# Altium schematic sheet BI5.SchDoc
size 420 x 297 mm; DocumentNumber: 10; SheetNumber: 10; SheetTotal: 13; DecimalNumber: СНАБ.468222.001 ЭЗ
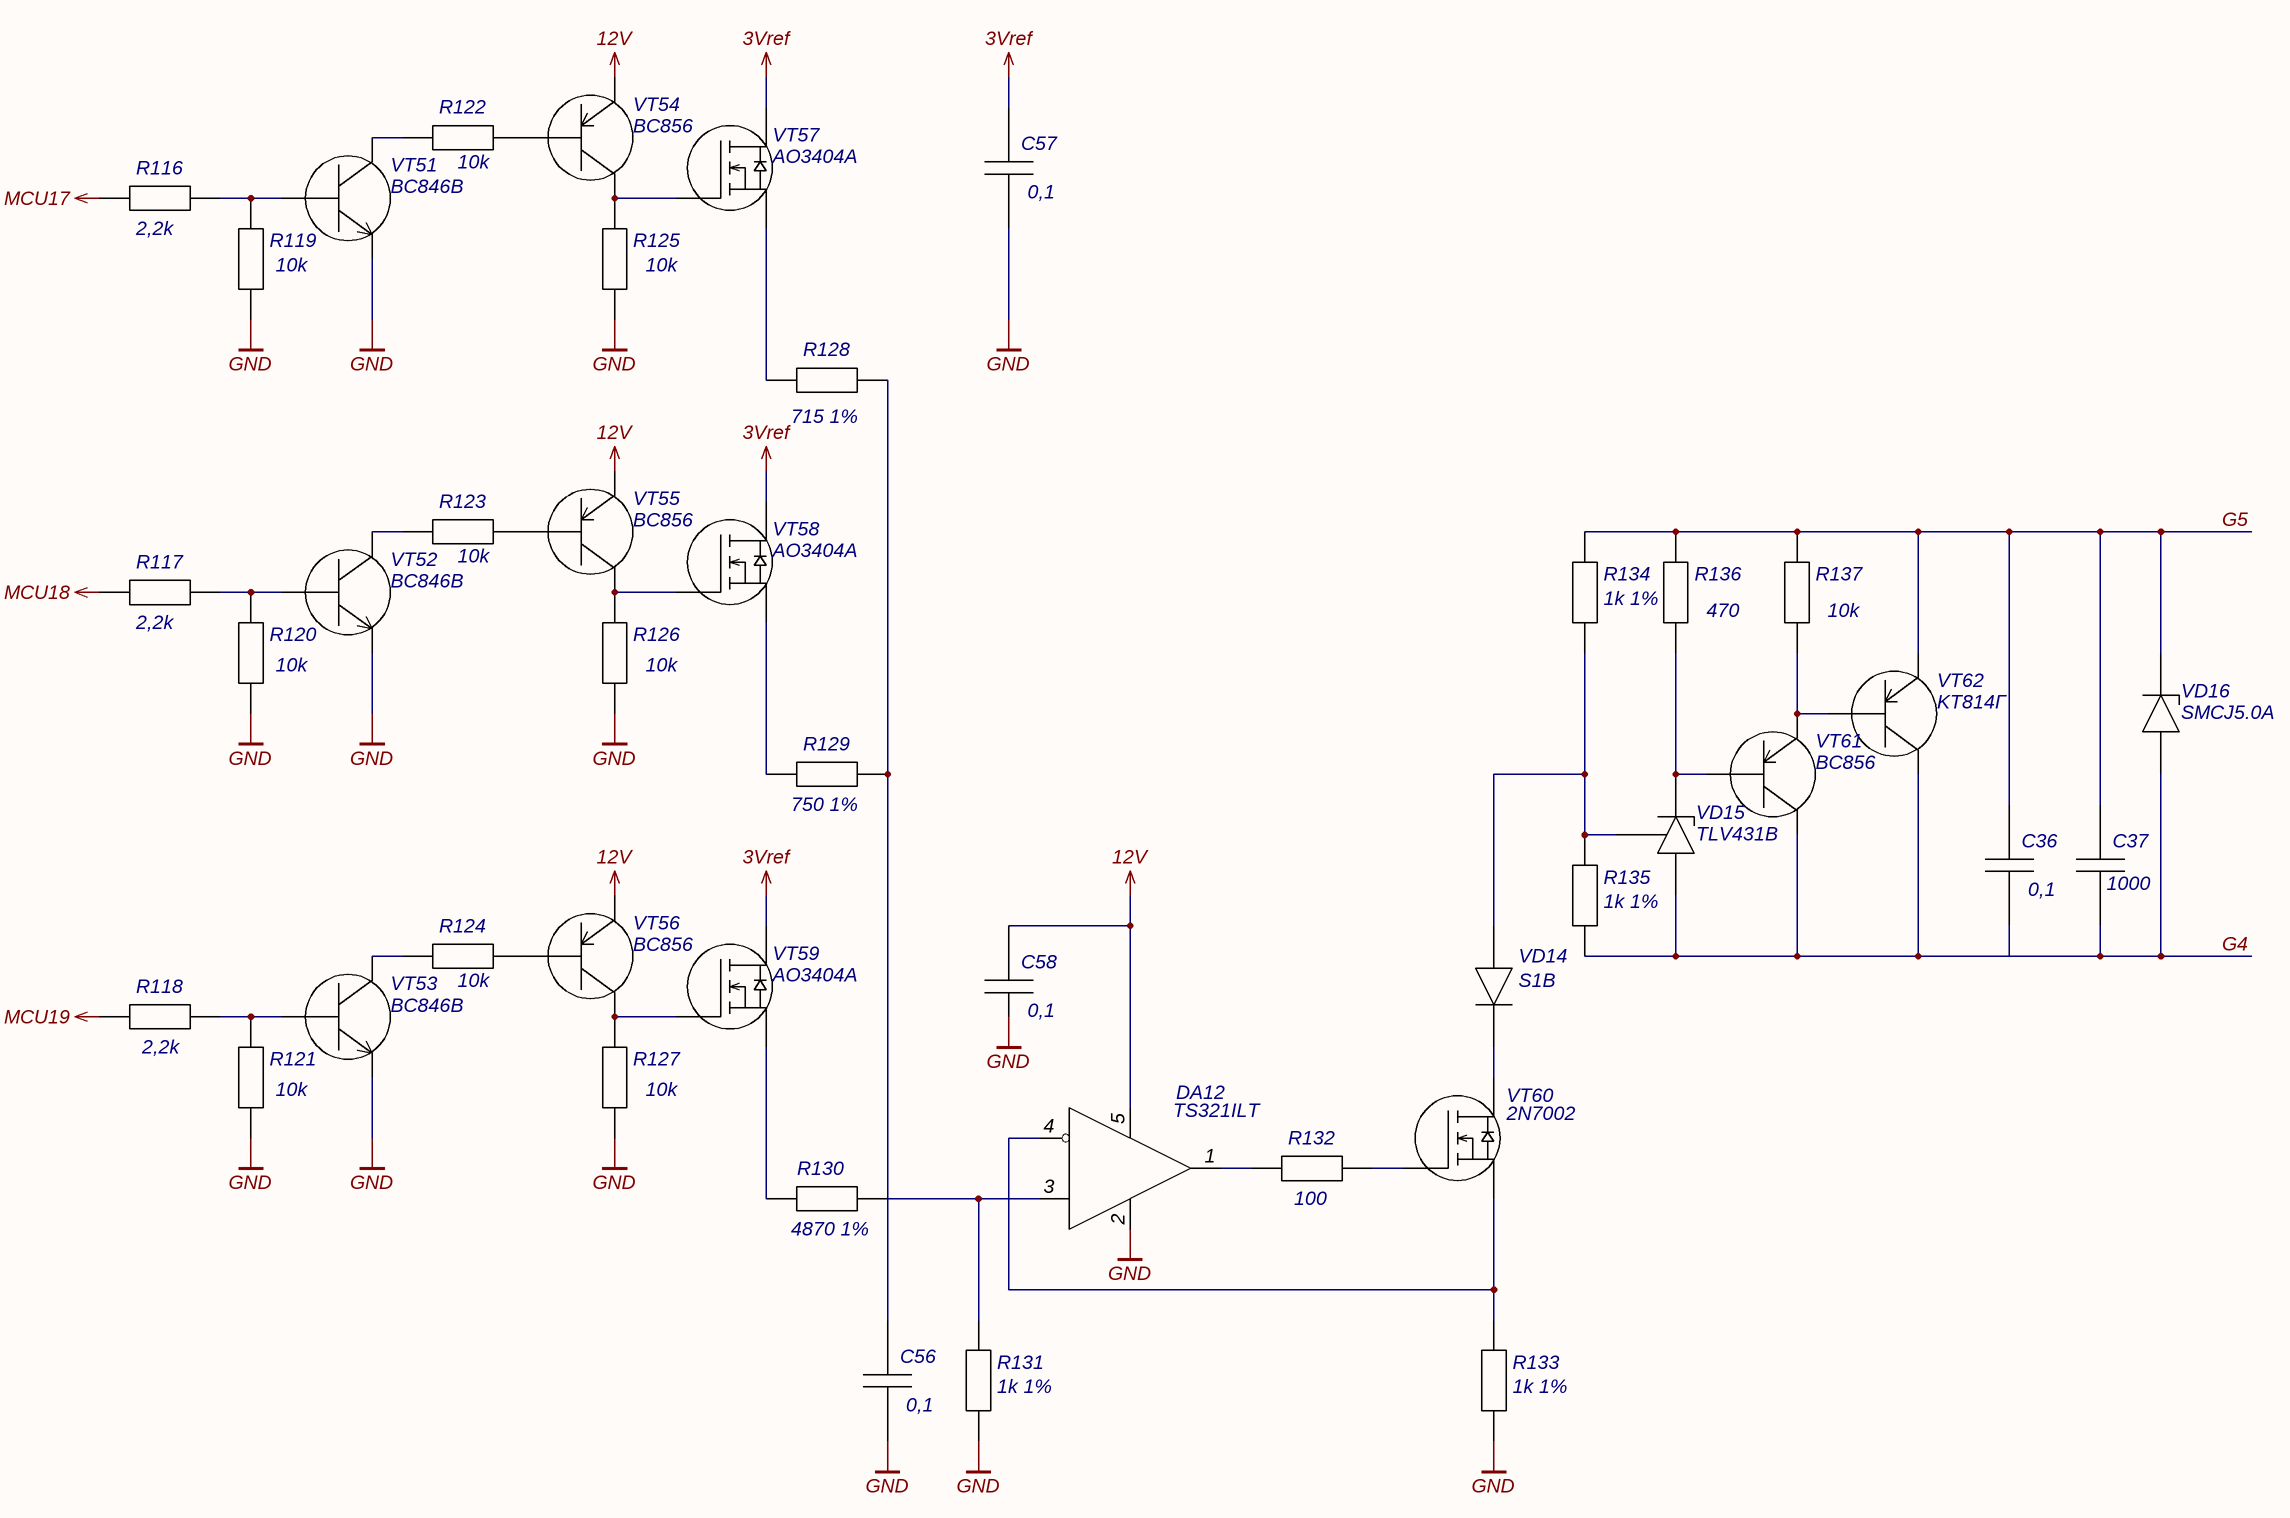
[diagram p0: BI5.SchDoc]

## Parts
C36  0,1  [C0603]
C37  1000  [C0603]
C56  0,1  [C0603]
C57  0,1  [C0603]
C58  0,1  [C0603]
DA12  TS321ILT  [SOT-23-5]
R116  2,2k  [R0603]
R117  2,2k  [R0603]
R118  2,2k  [R0603]
R119  10k  [R0603]
R120  10k  [R0603]
R121  10k  [R0603]
R122  10k  [R0603]
R123  10k  [R0603]
R124  10k  [R0603]
R125  10k  [R0603]
R126  10k  [R0603]
R127  10k  [R0603]
R128  715 1%  [R0603]
R129  750 1%  [R0603]
R130  4870 1%  [R0603]
R131  1k 1%  [R0603]
R132  100  [R0603]
R133  1k 1%  [R0603]
R134  1k 1%  [R0603]
R135  1k 1%  [R0603]
R136  470  [R0603]
R137  10k  [R0603]
VD14  S1B  [DO-214AC]
VD15  TLV431B  [SOT-23]
VD16  SMCJ5.0A  [DO-214AB]
VT51  BC846B  [SOT-23]
VT52  BC846B  [SOT-23]
VT53  BC846B  [SOT-23]
VT54  BC856  [SOT-23]
VT55  BC856  [SOT-23]
VT56  BC856  [SOT-23]
VT57  AO3404A  [SOT-23]
VT58  AO3404A  [SOT-23]
VT59  AO3404A  [SOT-23]
VT60  2N7002  [SOT-23]
VT61  BC856  [SOT-23]
VT62  KT814Г  [TO-126]

## Nets
3Vref: C57.2 VT57.2(D) VT58.2(D) VT59.2(D)
12V: C58.2 DA12.5(Vcc) VT54.1 VT55.1 VT56.1
GND: C56.1 C57.1 DA12.2(GND) R119.1 R120.1 R121.1 R125.1 R126.1 R127.1 R131.1 R133.1 VT51.2(E) VT52.2(E) VT53.2(E)
MCU17: R116.1
MCU18: R117.1
MCU19: R118.1
G4: C36.1 C37.1 R135.1 VD15.1 VD16.1 VT61.2 VT62.2
G5: C36.2 C37.2 R134.2 R136.2 R137.2 VD16.2 VT62.1
NetC56_2: C56.2 DA12.3(+) R128.2 R129.2 R130.2 R131.2
NetDA12_1: DA12.1(OUT) R132.1
NetDA12_4: DA12.4(-) R133.2 VT60.3(S)
NetR116_2: R116.2 R119.2 VT51.1(B)
NetR117_2: R117.2 R120.2 VT52.1(B)
NetR118_2: R118.2 R121.2 VT53.1(B)
NetR122_1: R122.1 VT51.3(C)
NetR122_2: R122.2 VT54.3
NetR123_1: R123.1 VT52.3(C)
NetR123_2: R123.2 VT55.3
NetR124_1: R124.1 VT53.3(C)
NetR124_2: R124.2 VT56.3
NetR125_2: R125.2 VT54.2 VT57.1(G)
NetR126_2: R126.2 VT55.2 VT58.1(G)
NetR127_2: R127.2 VT56.2 VT59.1(G)
NetR128_1: R128.1 VT57.3(S)
NetR129_1: R129.1 VT58.3(S)
NetR130_1: R130.1 VT59.3(S)
NetR132_2: R132.2 VT60.1(G)
NetR134_1: R134.1 R135.2 VD14.1 VD15.3
NetR136_1: R136.1 VD15.2 VT61.3
NetR137_1: R137.1 VT61.1 VT62.3
NetVD14_2: VD14.2 VT60.2(D)

Not connected (* = marked no-connect by the designer): C58 1

## Notes on the sheet
- Labels drawn without touching a wire or pin: GND
- Подп. и дата
- Инв.№ дубл.
- Взам.инв.№
- Подп.и дата
- Инв.№ подл.
- Изм.
- Лист
- № докум.
- Подп.
- Дата
- Копировал
- Формат  A3

## Library data of the parts
C36 C37 C56-C58 = Chip Capasitor: Чип-конденсатор
  C36 C56-C58: Value: 0,1
  C37: Value: 1000
DA12 = TS321ILT: 1х Операционный усилитель; Manufacurer: STMicroelectronics; Case: SOT-23-5; Name: TS321ILT; Datasheet: https://static.chipdip.ru/lib/710/DOC011710227.pdf
R116-R127 R132 R136 R137 = Chip Resistor: Чип-резистор
  R116-R118: Value: 2,2k
  R119-R127 R137: Value: 10k
  R132: Value: 100
  R136: Value: 470
R128 = Chip Resistor: Чип-резистор; Partnumber: RC0603FR-07715RL; Value: 715 1%; URL: https://www.chipdip.ru/product0/8002000768
R129 = Chip Resistor: Чип-резистор; Partnumber: RC0603FR-07750RL; Value: 750 1%; URL: https://www.chipdip.ru/product/0.1w-0603-750-om-1
R130 = Chip Resistor: Чип-резистор; Partnumber: RC0603FR-074K87L; Value: 4870 1%; URL: https://www.chipdip.ru/product0/8002000679
R131 R133-R135 = Chip Resistor: Чип-резистор; Partnumber: CRCW06031K00FKEAC; Value: 1k 1%; URL: https://www.chipdip.ru/product0/8002019285
VD14 = S1B: Диод выпрямительный, 100В; Manufacturer: Diotec Semiconductor; Case: DO-214AC; Name: S1B; Datasheet: https://static.chipdip.ru/lib/113/DOC032113174.pdf
VD15 = TLV431B: Стабилитрон регулируемый, 6В; Manufacturer: Texas Instruments; Case: SOT-23; Name: TLV431B; Datasheet: https://static.chipdip.ru/lib/985/DOC012985043.pdf
VD16 = SMCJ5.0A: Защитный диод, 5В; Manufacturer: UTD Semiconductor Co.,Ltd; Case: DO-201; Name: SMCJ5.0A; Datasheet: https://static.chipdip.ru/lib/863/DOC025863760.pdf
VT51-VT53 = BC846B: Транзистор биполярный NPN, 65В; Manufacturer: Nexperia B.V.; Case: SOT-23; Name: BC846B; Datasheet: https://static.chipdip.ru/lib/551/DOC012551042.pdf
VT54-VT56 VT61 = BC856: Транзистор биполярный PNP, 65В; Manufacturer: Nexperia; Case: SOT-23; Name: BC856; Datasheet: https://static.chipdip.ru/lib/365/DOC004365998.pdf
VT57-VT59 = AO3404A: Транзистор MOSFET N-канал, 30В; Manufacturer: UTD Semiconductor Co.,Ltd; Case: SOT-23; Name: AO3404A; Datasheet: https://static.chipdip.ru/lib/906/DOC012906979.pdf
VT60 = 2N7002: Транзистор MOSFET N-канал, 60В; Manufacturer: UTD Semiconductor Co.; Case: SOT-23; Name: 2N7002; Datasheet: https://static.chipdip.ru/lib/301/DOC021301072.pdf
VT62 = KT814Г: Транзистор биполярный PNP, 100В; Manufacturer: АО «ГРУППА КРЕМНИЙ ЭЛ»; TU: аАО.336.184 ТУ/02; Case: TO-126; Name: KT814Г; Datasheet: https://static.chipdip.ru/lib/404/DOC047404057.pdf